# Altium schematic sheet JTAG&Trace.SchDoc: JTAG & Trace
size A4; DocumentNumber: MB1246; Revision: B.1; SheetNumber: 17; SheetTotal: 17; Project: STM32H7xxI-EVAL
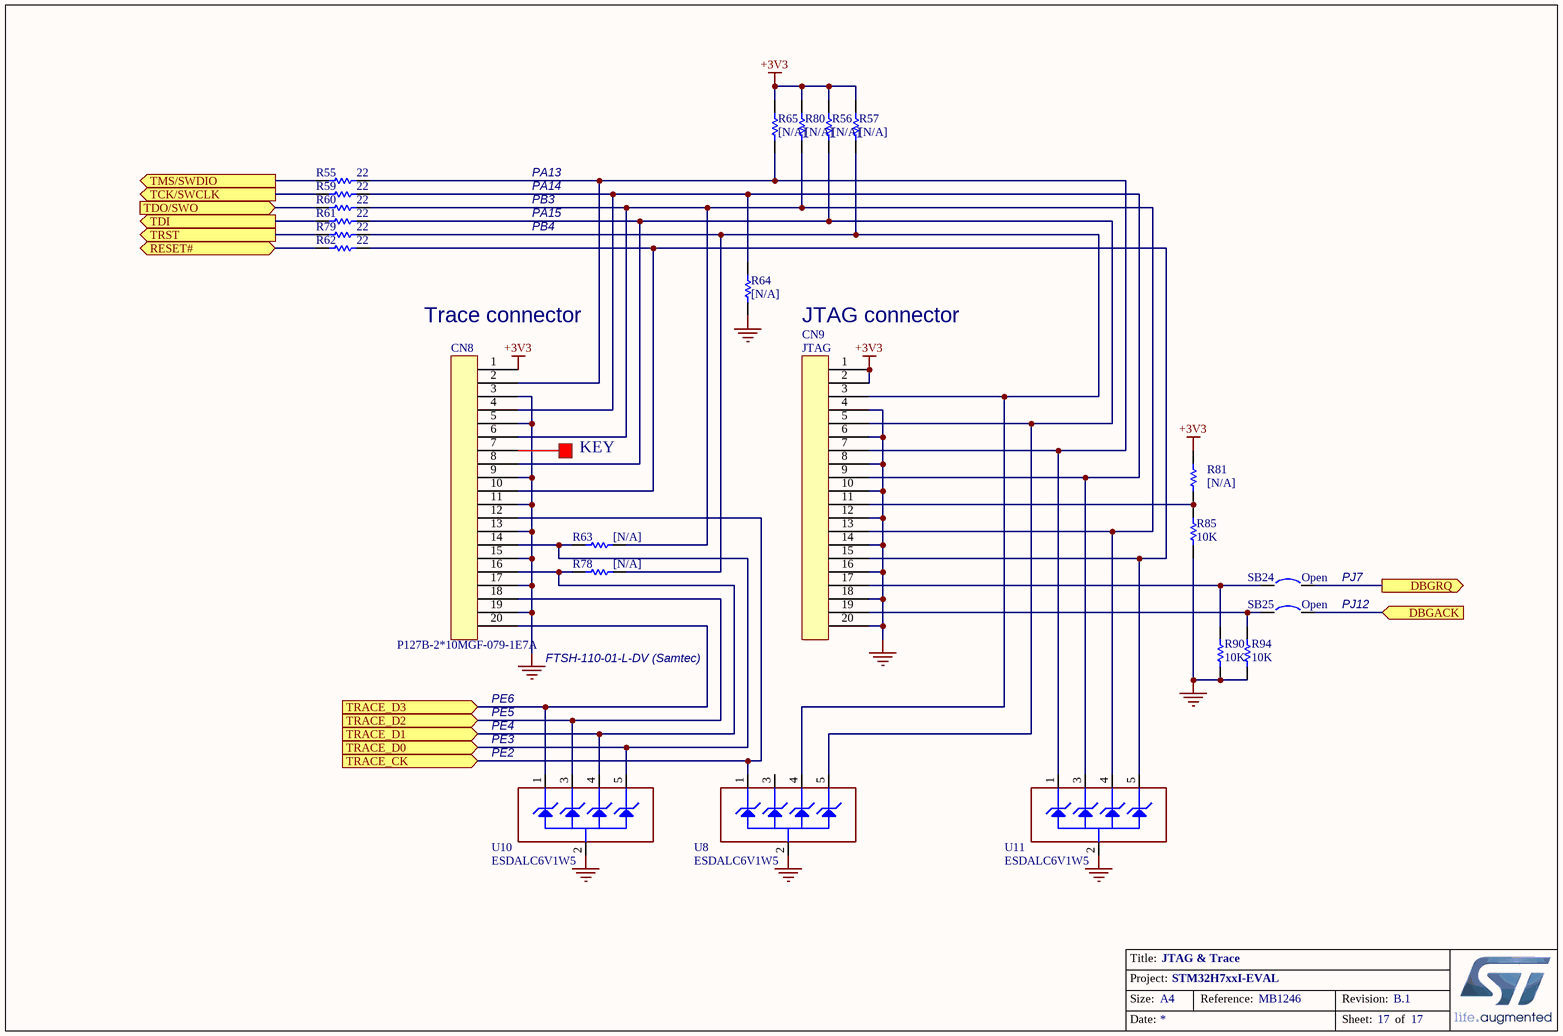
[diagram p0: JTAG&Trace.SchDoc]

## Parts
CN8  P127B-2*10MGF-079-1E7A  [FTSH-110-01-L-DV]
CN9  JTAG  [IDC20S]
R55  22  [0603R]
R56  [N/A]  [0603R]
R57  [N/A]  [0603R]
R59  22  [0603R]
R60  22  [0603R]
R61  22  [0603R]
R62  22  [0603R]
R63  [N/A]  [0603R]
R64  [N/A]  [0603R]
R65  [N/A]  [0603R]
R78  [N/A]  [0603R]
R79  22  [0603R]
R80  [N/A]  [0603R]
R81  [N/A]  [0603R]
R85  10K  [0603R]
R90  10K  [0603R]
R94  10K  [0603R]
SB24  Open  [SB_0603]
SB25  Open  [SB_0603]
U8  ESDALC6V1W5  [SOT-353]
U10  ESDALC6V1W5  [SOT-353]
U11  ESDALC6V1W5  [SOT-353]

## Ports
DBGACK (in), DBGRQ (out), RESET# (bidir), TCK/SWCLK (out), TDI (out), TDO/SWO (in), TMS/SWDIO (out), TRACE_CK (in), TRACE_D0 (in), TRACE_D1 (in), TRACE_D2 (in), TRACE_D3 (in), TRST (out)

## Nets
+3V3: CN8.1 CN9.1 CN9.2 R56.2 R57.2 R65.2 R80.2 R81.2
GND: CN8.3 CN8.5 CN8.9 CN8.11 CN8.13 CN8.15 CN8.17 CN8.19 CN9.4 CN9.6 CN9.8 CN9.10 CN9.12 CN9.14 CN9.16 CN9.18 CN9.20 R64.1 R85.1 R90.1 R94.1 U8.2(GND) U10.2(GND) U11.2(GND)
DBGACK: SB25.2 ; port DBGACK
DBGRQ: SB24.2 ; port DBGRQ
RESET#: R62.2 ; port RESET#
TCK/SWCLK: R59.2 ; port TCK/SWCLK
TDI: R61.2 ; port TDI
TDO/SWO: R60.2 ; port TDO/SWO
TMS/SWDIO: R55.2 ; port TMS/SWDIO
TRACE_CK: CN8.12 U8.1(IO1) ; port TRACE_CK
TRACE_D0: CN8.14 R63.1 U10.5(IO4) ; port TRACE_D0
TRACE_D1: CN8.16 R78.1 U10.4(IO3) ; port TRACE_D1
TRACE_D2: CN8.18 U10.3(IO2) ; port TRACE_D2
TRACE_D3: CN8.20 U10.1(IO1) ; port TRACE_D3
TRST: R79.2 ; port TRST
NetCN8_2: CN8.2 CN9.7 R55.1 R65.1 U11.1(IO1)
NetCN8_4: CN8.4 CN9.9 R59.1 R64.2 U11.3(IO2)
NetCN8_6: CN8.6 CN9.13 R60.1 R63.2 R80.1 U11.4(IO3)
NetCN8_8: CN8.8 CN9.5 R56.1 R61.1 U8.5(IO4)
NetCN8_10: CN8.10 CN9.15 R62.1 U11.5(IO4)
NetCN9_3: CN9.3 R57.1 R78.2 R79.1 U8.4(IO3)
NetCN9_11: CN9.11 R81.1 R85.2
NetCN9_17: CN9.17 R90.2 SB24.1
NetCN9_19: CN9.19 R94.2 SB25.1

Not connected (* = marked no-connect by the designer): CN8 7; U8 3(IO2)

## Notes on the sheet
- PA13
- PA14
- PB3
- PA15
- PB4
- (near CN8) Trace connector
- JTAG connector
- KEY
- PJ7
- PJ12
- PE6
- PE5
- (near CN8) FTSH-110-01-L-DV (Samtec)
- PE4
- PE3
- (near U10) PE2
- Title:
- Project:
- Size:
- Date:
- A4
- Reference:
- Sheet:
- Revision:
- of

## Library data of the parts
CN8 CN9 = 20PIN1
R55-R57 R59-R65 R78-R81 R85 R90 R94 = Res1: Resistor; Value: 1K; Published: 8-Jun-2000; Revision: July-2002: Re-released for DXP Platform.; Publisher: Altium Limited
SB24 SB25 = Circuit Breaker: Published: 24-Mar-1999; Revision: July-2002: Re-released for DXP Platform.; Publisher: Altium Limited
U8 U10 U11 = ESDALC6V1W5: Dual Transil array for ESD protection; Manuf_1: STM; Manuf_Part_1: ESDA5V3L; Ref St: 9179034; Provided: ST; ECCN_US/EU: EAR99/NEC; Distrib: ST; Order: ESDA5V3L; Ordered by: STM